# EAGLE design MW-Mega-Shield (EAGLE 9.0.1)
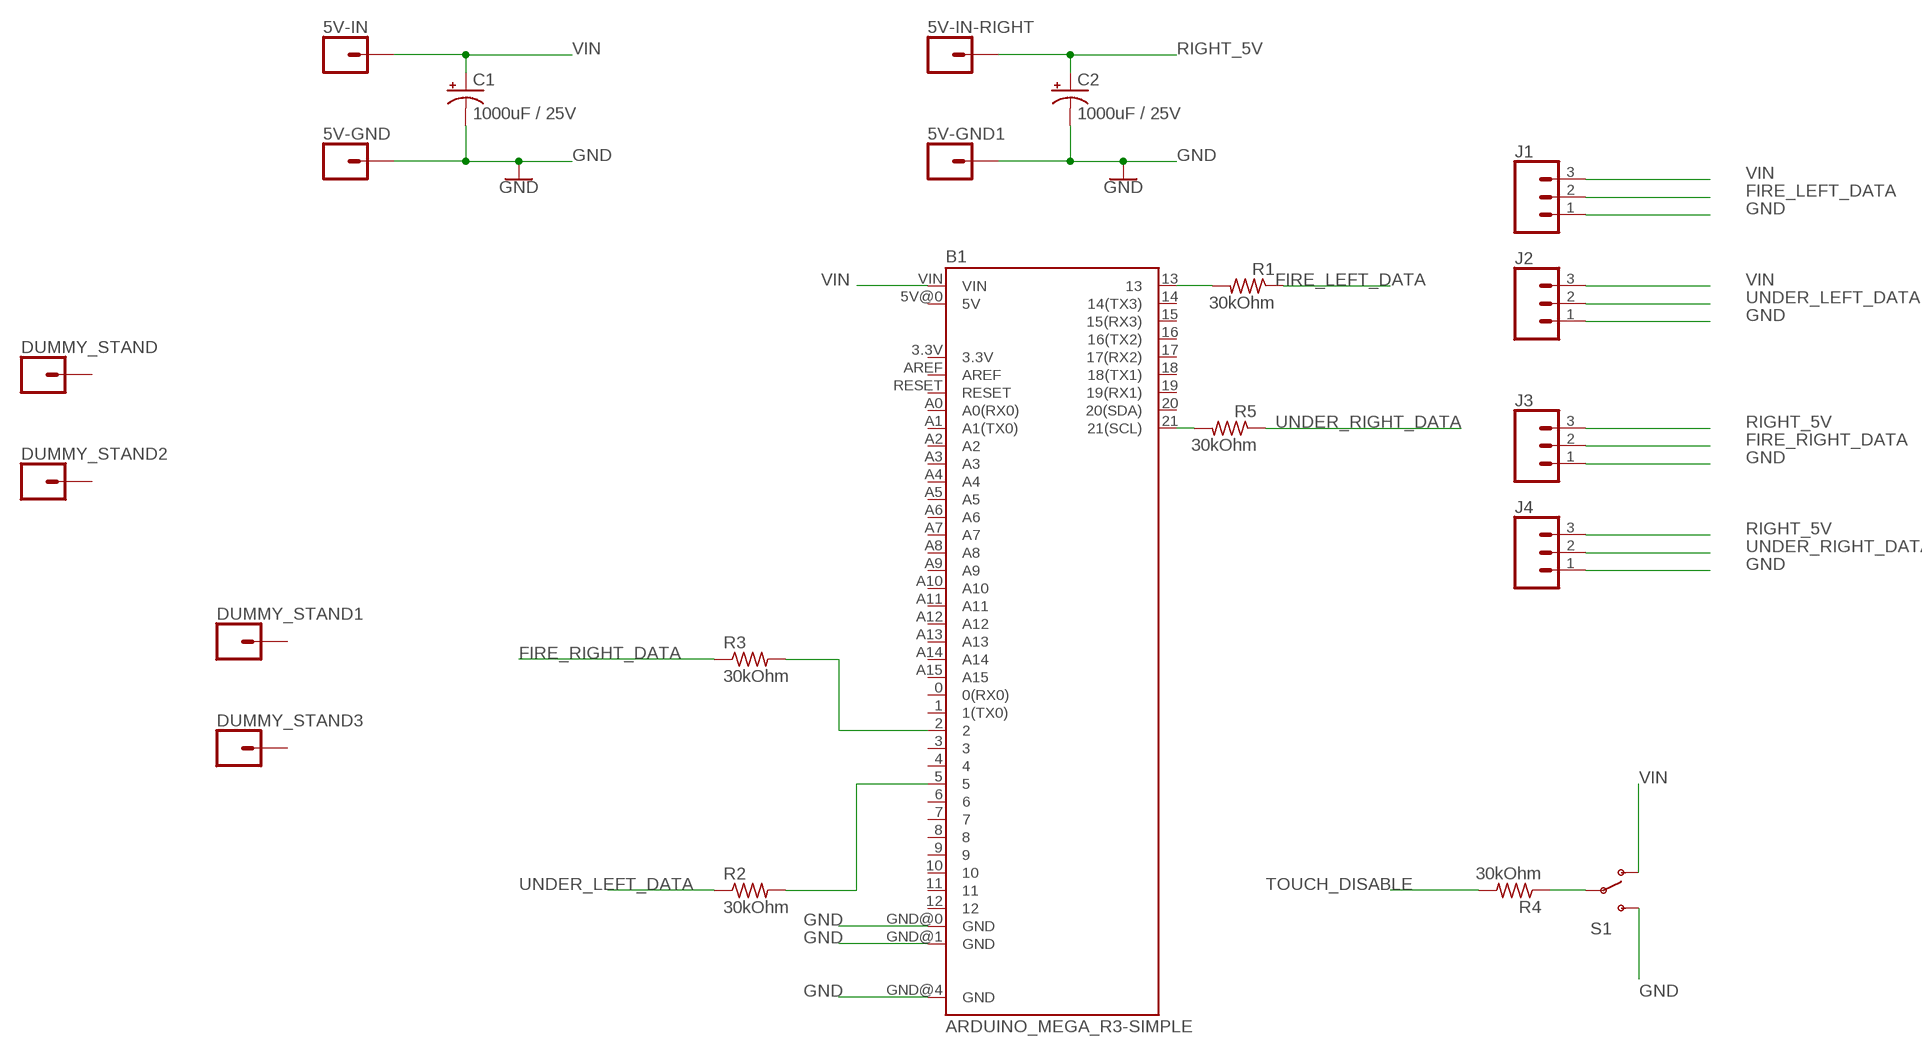
[diagram p0: schematic, sheet 1]

## Parts
5V-GND  CONN_01  [1X01]
5V-GND1  CONN_01  [1X01]
5V-IN  CONN_01  [1X01]
5V-IN-RIGHT  CONN_01  [1X01]
B1  ARDUINO_MEGA_R3-SIMPLE  [ARDUINO_MEGA-SIMPLE_SHIELD]
C1  1000uF / 25V  CPOL-USE5-10.5  [E5-10,5]
C2  1000uF / 25V  CPOL-USE5-10.5  [E5-10,5]
DUMMY_STAND  CONN_01  [1X01]
DUMMY_STAND1  CONN_01  [1X01]
DUMMY_STAND2  CONN_01  [1X01]
DUMMY_STAND3  CONN_01  [1X01]
J1  CONN_03SCREW-NS  [SCREWTERMINAL-3.5MM-3-NS]
J2  CONN_03SCREW-NS  [SCREWTERMINAL-3.5MM-3-NS]
J3  CONN_03SCREW-NS  [SCREWTERMINAL-3.5MM-3-NS]
J4  CONN_03SCREW-NS  [SCREWTERMINAL-3.5MM-3-NS]
R1  30kOhm  R-US_R0603  [R0603]
R2  30kOhm  R-US_R0603  [R0603]
R3  30kOhm  R-US_R0603  [R0603]
R4  30kOhm  R-US_R0603  [R0603]
R5  30kOhm  R-US_R0603  [R0603]
S1  SWITCH-SPDTSMD  [SWITCH_SPDT_SMD]

## Nets
FIRE_LEFT_DATA: J1.2 R1.1
FIRE_RIGHT_DATA: J3.2 R3.1
GND: 5V-GND1.1 5V-GND.1 B1.GND@0(GND) B1.GND@1(GND) B1.GND@4(GND) C1.- C2.- J1.1 J2.1 J3.1 J4.1 S1.3(S)
N$1: B1.13 R1.2
N$2: B1.5 R2.2
N$3: R4.1 S1.2(P)
N$4: B1.2 R3.2
N$5: B1.21(21(SCL)) R5.2
RIGHT_5V: 5V-IN-RIGHT.1 C2.+ J3.3 J4.3
TOUCH_DISABLE: R4.2
UNDER_LEFT_DATA: J2.2 R2.1
UNDER_RIGHT_DATA: J4.2 R5.1
VIN: 5V-IN.1 B1.VIN C1.+ J1.3 J2.3 S1.1(O)
Unconnected: B1.0(0(RX0)) B1.1(1(TX0)) B1.3 B1.3.3V B1.4 B1.5V@0(5V) B1.6 B1.7 B1.8 B1.9 B1.10 B1.11 B1.12 B1.14(14(TX3)) B1.15(15(RX3)) B1.16(16(TX2)) B1.17(17(RX2)) B1.18(18(TX1)) B1.19(19(RX1)) B1.20(20(SDA)) B1.A0(A0(RX0)) B1.A1(A1(TX0)) B1.A2 B1.A3 B1.A4 B1.A5 B1.A6 B1.A7 B1.A8 B1.A9 B1.A10 B1.A11 B1.A12 B1.A13 B1.A14 B1.A15 B1.AREF B1.RESET DUMMY_STAND1.1 DUMMY_STAND2.1 DUMMY_STAND3.1 DUMMY_STAND.1

## Library data of the parts
5V-GND 5V-GND1 5V-IN 5V-IN-RIGHT DUMMY_STAND DUMMY_STAND1-DUMMY_STAND3 = SparkFun-Connectors:CONN_01: Single connection point. Often used as Generic Header-pin footprint for 0.1 inch spaced/style header connections On any of the 0.1 inch spaced packages, you can populate with these: Break Away Headers - Straight <https://www.sparkfun.com/products/116> (PRT-00116) Break Away Male Headers - Right Angle <https://www.sparkfun.com/products/553> (PRT-00553) Female Headers <https://www.sparkfun.com/products/115> (PRT-00115) Break Away Headers - Machine Pin <https://www.sparkfun.com/products/117> (PRT-00117) Break Away Female Headers - Swiss Machine Pin <https://www.sparkfun.com/products/743> (PRT-00743) This device is also useful as a general connection point to wire up your design to another part of your project. Our various solder wires solder well into these plated through hole pads. Hook-Up Wire - Assortment (Stranded, 22 AWG) <https://www.sparkfun.com/products/11375> (PRT-11375) Hook-Up Wire - Assortment (Solid Core, 22 AWG) <https://www.sparkfun.com/products/11367> (PRT-11367) View the entire wire category on our website here <https://www.sparkfun.com/categories/141> Special notes: SMTSO-256-ET is a "flush mount" nut for a 4-40 screw. We mostly use this on specialty testbeds; it is a nice way to connect hardware to your PCB at an adjustable hieght. Also note, the SNAP packages are for using a snappable style connector. We sell a baggie of snaps and they are also used on two LilyPad designs: Snap Assortment - 30 pack (male and female) <https://www.sparkfun.com/products/11347> (DEV-11347) LilyPad Arduino SimpleSnap <https://www.sparkfun.com/products/10941> (DEV-10941) LilyPad SimpleSnap Protoboard <https://www.sparkfun.com/products/10940> (DEV-10940)
B1 = SparkFun-Boards:ARDUINO_MEGA_R3-SIMPLE: Arduino Mega R3 ATmega2560 R3 compatible footprint. SparkFun Products: Arduino Mega 2560 R3 <https://www.sparkfun.com/products/11061>
C1 C2 = rcl:CPOL-US: POLARIZED CAPACITOR, American symbol; SPICEPREFIX: C
J1-J4 = SparkFun-Connectors:CONN_03: Multi connection point. Often used as Generic Header-pin footprint for 0.1 inch spaced/style header connections On any of the 0.1 inch spaced packages, you can populate with these: Break Away Headers - Straight <https://www.sparkfun.com/products/116> (PRT-00116) Break Away Male Headers - Right Angle <https://www.sparkfun.com/products/553> (PRT-00553) Female Headers <https://www.sparkfun.com/products/115> (PRT-00115) Break Away Headers - Machine Pin <https://www.sparkfun.com/products/117> (PRT-00117) Break Away Female Headers - Swiss Machine Pin <https://www.sparkfun.com/products/743> (PRT-00743) Stackable Header - 3 Pin (Female, 0.1") <https://www.sparkfun.com/products/13875> (PRT-13875) For SCREWTERMINALS and SPRING TERMINALS visit here: Screw Terimnals on SparkFun.com <https://www.sparkfun.com/search/results?term=Screw+Terminals> (5mm/3.5mm/2.54mm spacing) This device is also useful as a general connection point to wire up your design to another part of your project. Our various solder wires solder well into these plated through hole pads. Hook-Up Wire - Assortment (Stranded, 22 AWG) <https://www.sparkfun.com/products/11375> (PRT-11375) Hook-Up Wire - Assortment (Solid Core, 22 AWG) <https://www.sparkfun.com/products/11367> (PRT-11367) View the entire wire category on our website here <https://www.sparkfun.com/categories/141> Special notes: Molex polarized connector foot print use with SKU : PRT-08232 with associated crimp pins and housings.
R1-R5 = rcl:R-US_: RESISTOR, American symbol; SPICEPREFIX: R
S1 = SparkFun-Retired:SWITCH-SPDT: SPDT Switch Simple slide switch, Spark Fun Electronics SKU : COM-00102 DPDT SMT slide switch, AYZ0202, SWCH-08179

## Board
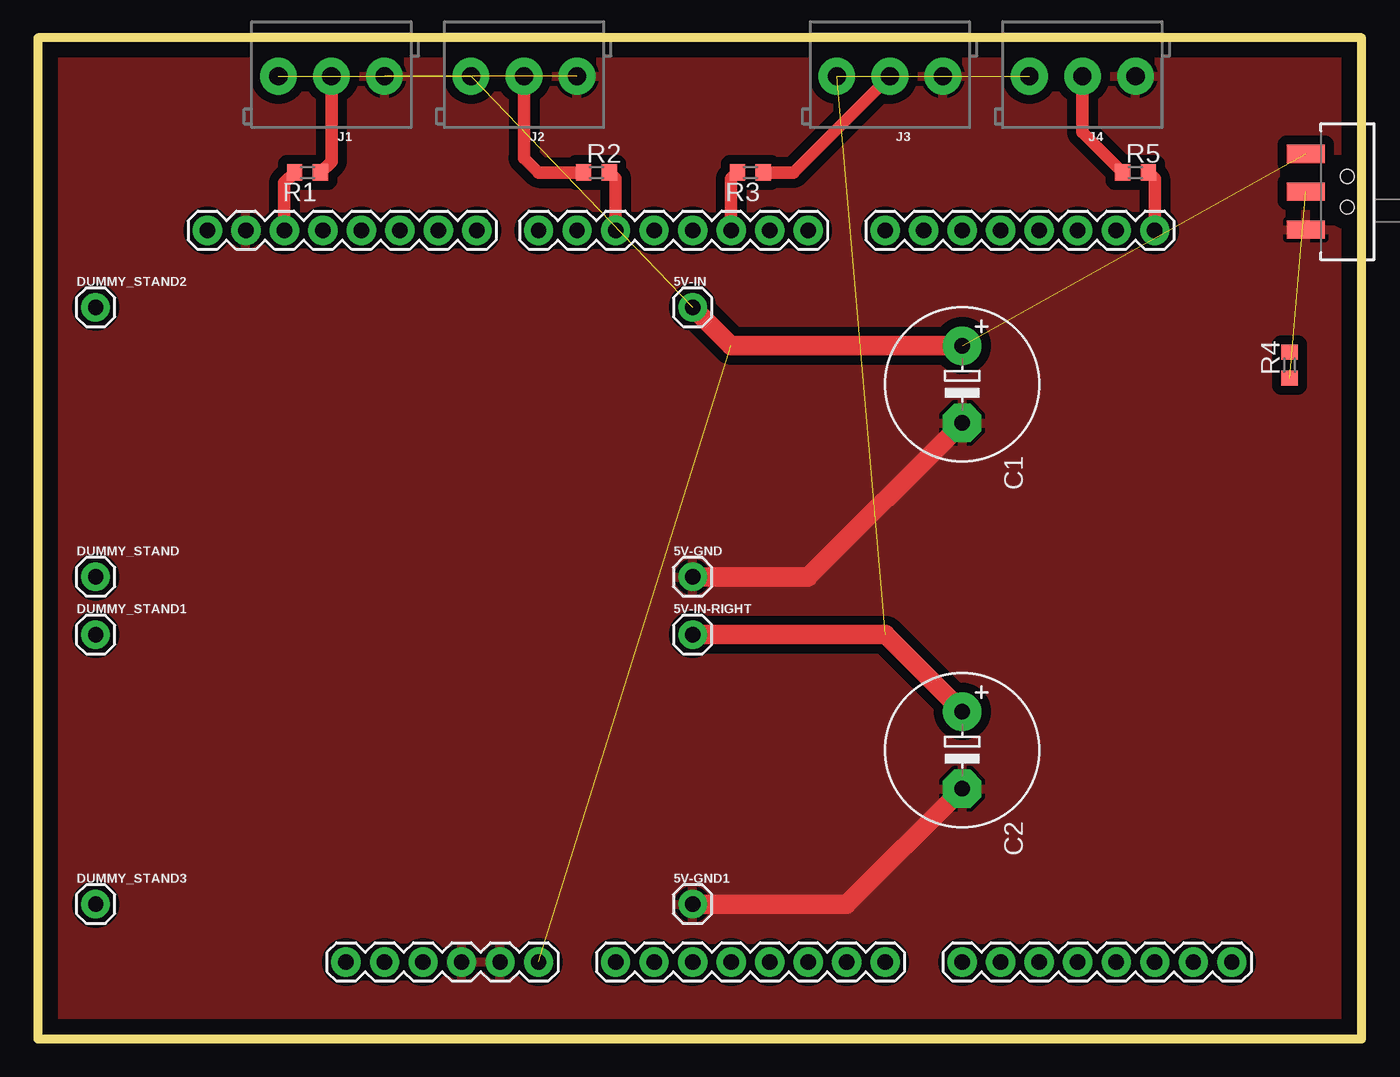
[diagram p1: board, top side]

Size 87.3 x 66.03 mm. Coordinates in mm from the lower left corner, seen from the top.
Outline: 0,0 87.3,0 87.3,66.03 0,66.03 0,0
Copper layers (1*16): Top 0.035mm / dielectric 1.5mm / Bottom 0.035mm
Design rules "default *": minimum track width 0.4mm, minimum drill 0.35mm, track to track 24mil, track to pad 24mil, pad to pad 24mil, via to via 24mil, smd to smd 24mil, copper to edge 40mil, drill to drill 6mil, minimum pad ring 10mil, minimum via ring 8mil, stop-mask expansion 4mil, vias tented up to drill 0mil, thermal gap 10mil

### Footprints (pad centres in the part's own frame; a part is rotated, then mirrored left to right if it is on the bottom)
1X01 = drill 1.016 pad 1.88: 1 0,0
ARDUINO_MEGA-SIMPLE_SHIELD = drill 1.016 pad 1.93: 0 13.97,24.13; 1 11.43,24.13; 2 8.89,24.13; 3 6.35,24.13; 3.3V -13.97,-24.13; 4 3.81,24.13; 5 1.27,24.13; 5V@0 -11.43,-24.13; 6 -1.27,24.13; 7 -3.81,24.13; 8 -7.874,24.13; 9 -10.414,24.13; 10 -12.954,24.13; 11 -15.494,24.13; 12 -18.034,24.13; 13 -20.574,24.13; 14 19.05,24.13; 15 21.59,24.13; 16 24.13,24.13; 17 26.67,24.13; 18 29.21,24.13; 19 31.75,24.13; 20 34.29,24.13; 21 36.83,24.13; A0 1.27,-24.13; A1 3.81,-24.13; A2 6.35,-24.13; A3 8.89,-24.13; A4 11.43,-24.13; A5 13.97,-24.13; A6 16.51,-24.13; A7 19.05,-24.13; A8 24.13,-24.13; A9 26.67,-24.13; A10 29.21,-24.13; A11 31.75,-24.13; A12 34.29,-24.13; A13 36.83,-24.13; A14 39.37,-24.13; A15 41.91,-24.13; AREF -25.654,24.13; GND@0 -8.89,-24.13; GND@1 -6.35,-24.13; GND@4 -23.114,24.13; RESET -16.51,-24.13; VIN -3.81,-24.13
E5-10,5 = drill 1.016 pad 2.54: + -2.54,0 | drill 1.016 pad 2.54 octagon: - 2.54,0
SCREWTERMINAL-3.5MM-3-NS = drill 1.2 pad 2.413: 1 0,0; 2 3.5,0; 3 7,0
R0603 = smd 1 x 1.1: 1 -0.85,0; 2 0.85,0
SWITCH_SPDT_SMD = smd 1.2 x 2.5: 1 -2.5,-2.75; 2 0,-2.75; 3 2.5,-2.75 | hole 0.9: -1.01,0; 1.01,0

### Placement (x,y rotation side)
5V-GND  43.18,30.48 0 top
5V-GND1  43.18,8.89 0 top
5V-IN  43.18,48.26 0 top
5V-IN-RIGHT  43.18,26.67 0 top
B1  36.83,29.21 0 top
C1  60.96,43.18 270 top
C2  60.96,19.05 270 top
DUMMY_STAND  3.81,30.48 0 top
DUMMY_STAND1  3.81,26.67 0 top
DUMMY_STAND2  3.81,48.26 0 top
DUMMY_STAND3  3.81,8.89 0 top
J1  22.86,63.5 180 top
J2  35.56,63.5 180 top
J3  59.69,63.5 180 top
J4  72.39,63.5 180 top
R1  17.78,57.15 180 top
R2  36.83,57.15 0 top
R3  46.99,57.15 180 top
R4  82.55,44.45 90 top
R5  72.39,57.15 0 top
S1  86.36,55.88 270 top

### Tracks (layer width: path | path; a pad name or v marks a point on that pad's centre or on a via)
FIRE_LEFT_DATA
  Top 0.813: R1.1 19.36,57.88 J1.2
FIRE_RIGHT_DATA
  Top 0.813: J3.2 49.84,57.15 R3.1
GND  (1 unrouted)
  Top 1.27: 5V-GND.1 50.8,30.48 C1.- | 5V-GND1.1 53.34,8.89 C2.-
  pour Top: 0,66.04 87.63,66.04 87.63,0 0,0
N$1
  Top 0.813: R1.2 16.26,56.48 B1.13
N$2
  Top 0.813: R2.2 38.1,56.73 B1.5
N$3  (1 unrouted)
N$4
  Top 0.813: R3.2 45.72,56.73 B1.2
N$5
  Top 0.813: R5.2 73.66,56.73 B1.21
RIGHT_5V  (2 unrouted)
  Top 1.27: 5V-IN-RIGHT.1 55.88,26.67 | 55.88,26.67 C2.+ | 55.88,26.67
UNDER_LEFT_DATA
  Top 0.813: J2.2 32.06,58.11 33.02,57.15 R2.1
UNDER_RIGHT_DATA
  Top 0.813: J4.2 68.89,59.8 R5.1
VIN  (4 unrouted)
  Top 1.27: 5V-IN.1 45.72,45.72 C1.+